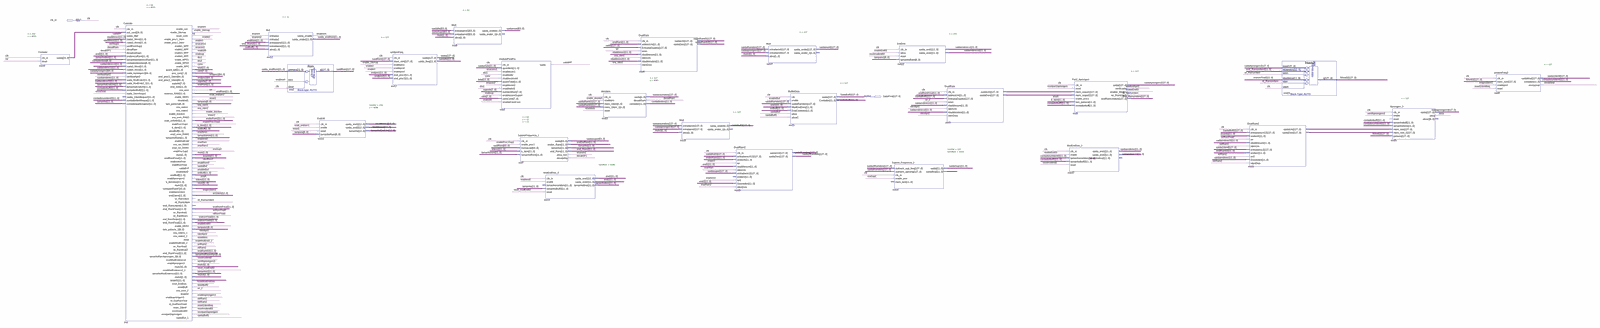
[diagram p0: schematic sheet, whole]
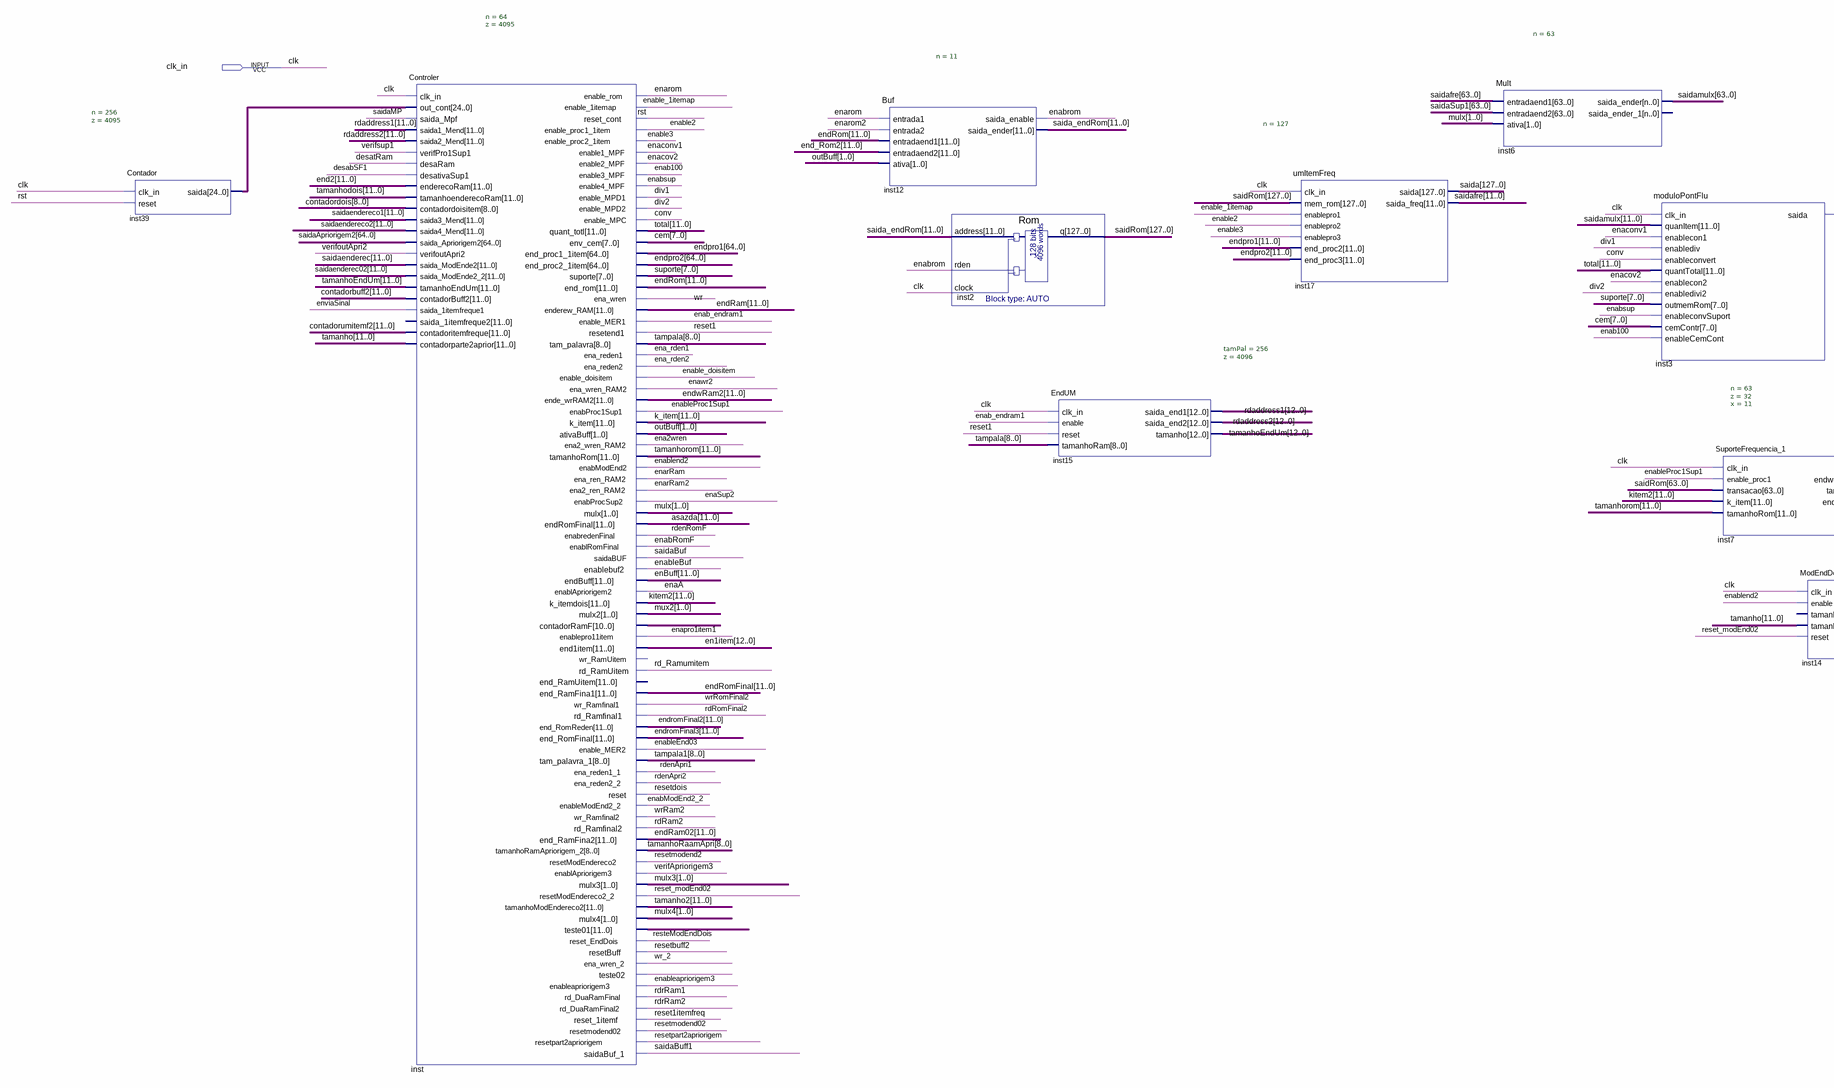
[diagram p1: schematic sheet, left part]
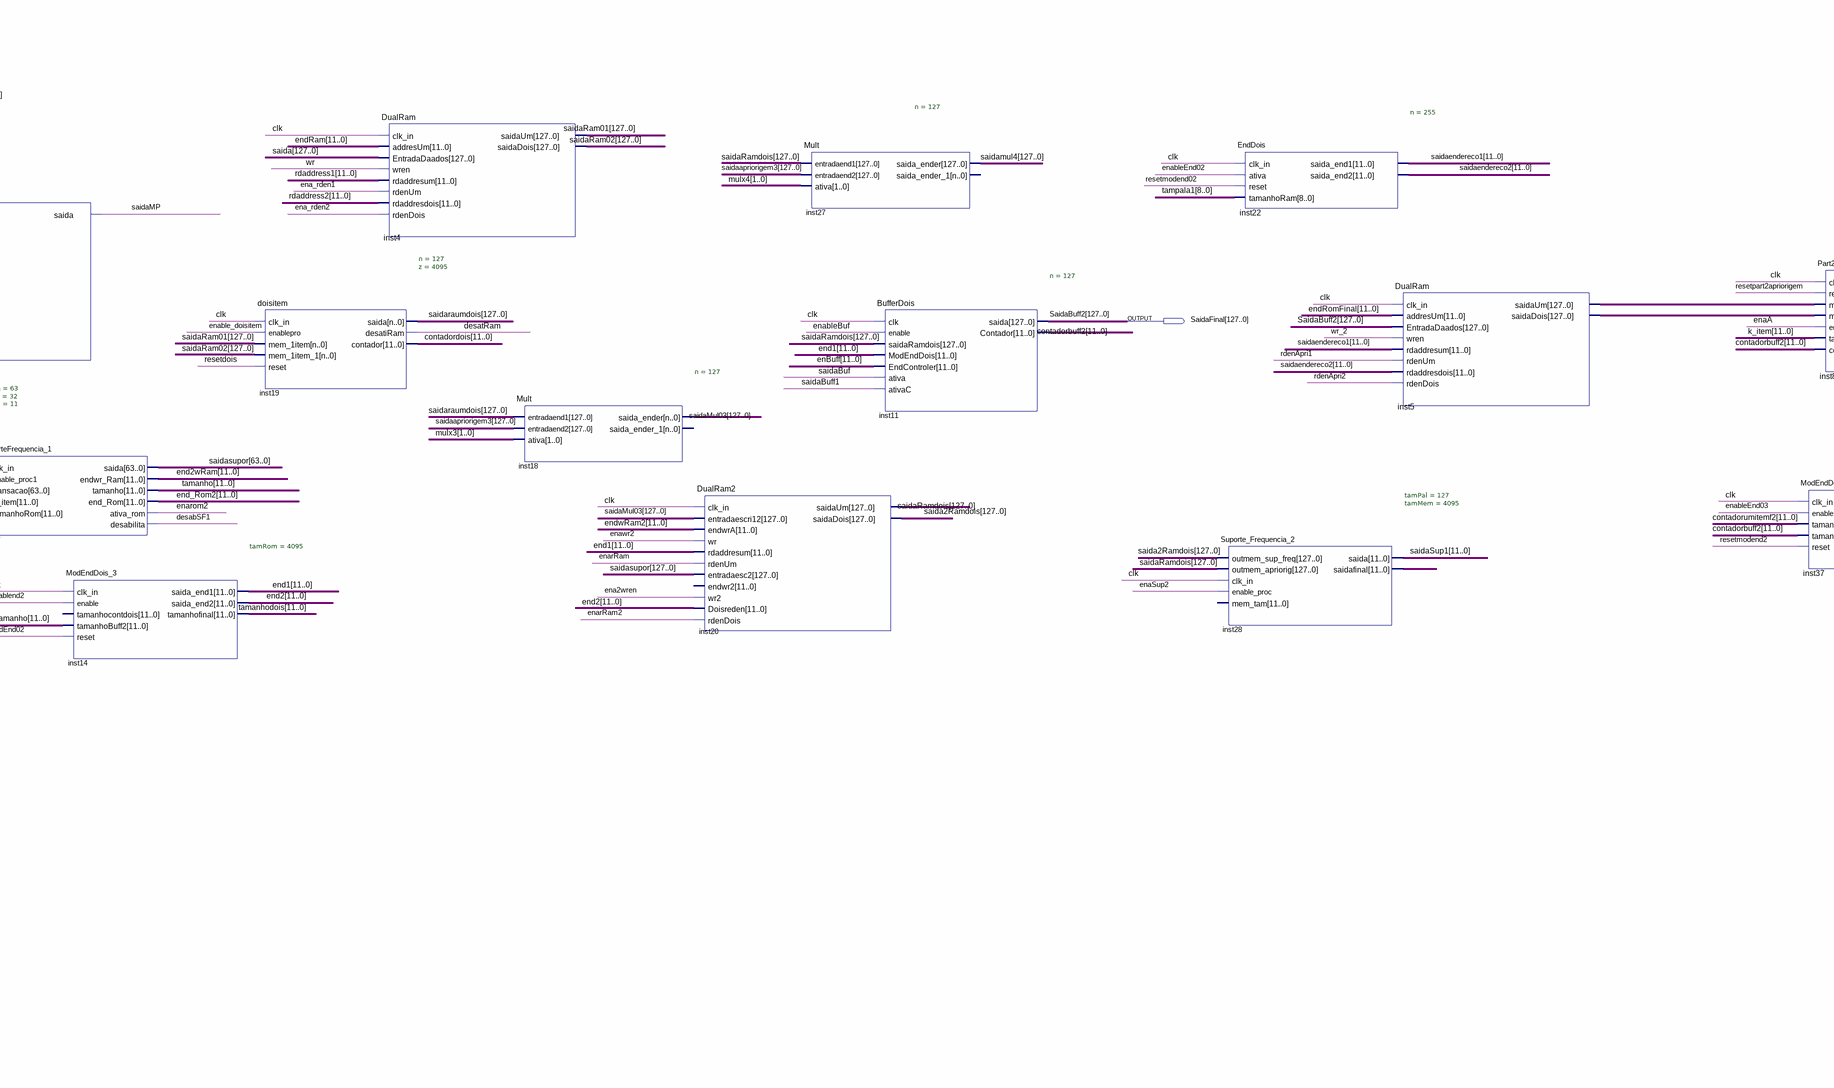
[diagram p2: schematic sheet, centre part]
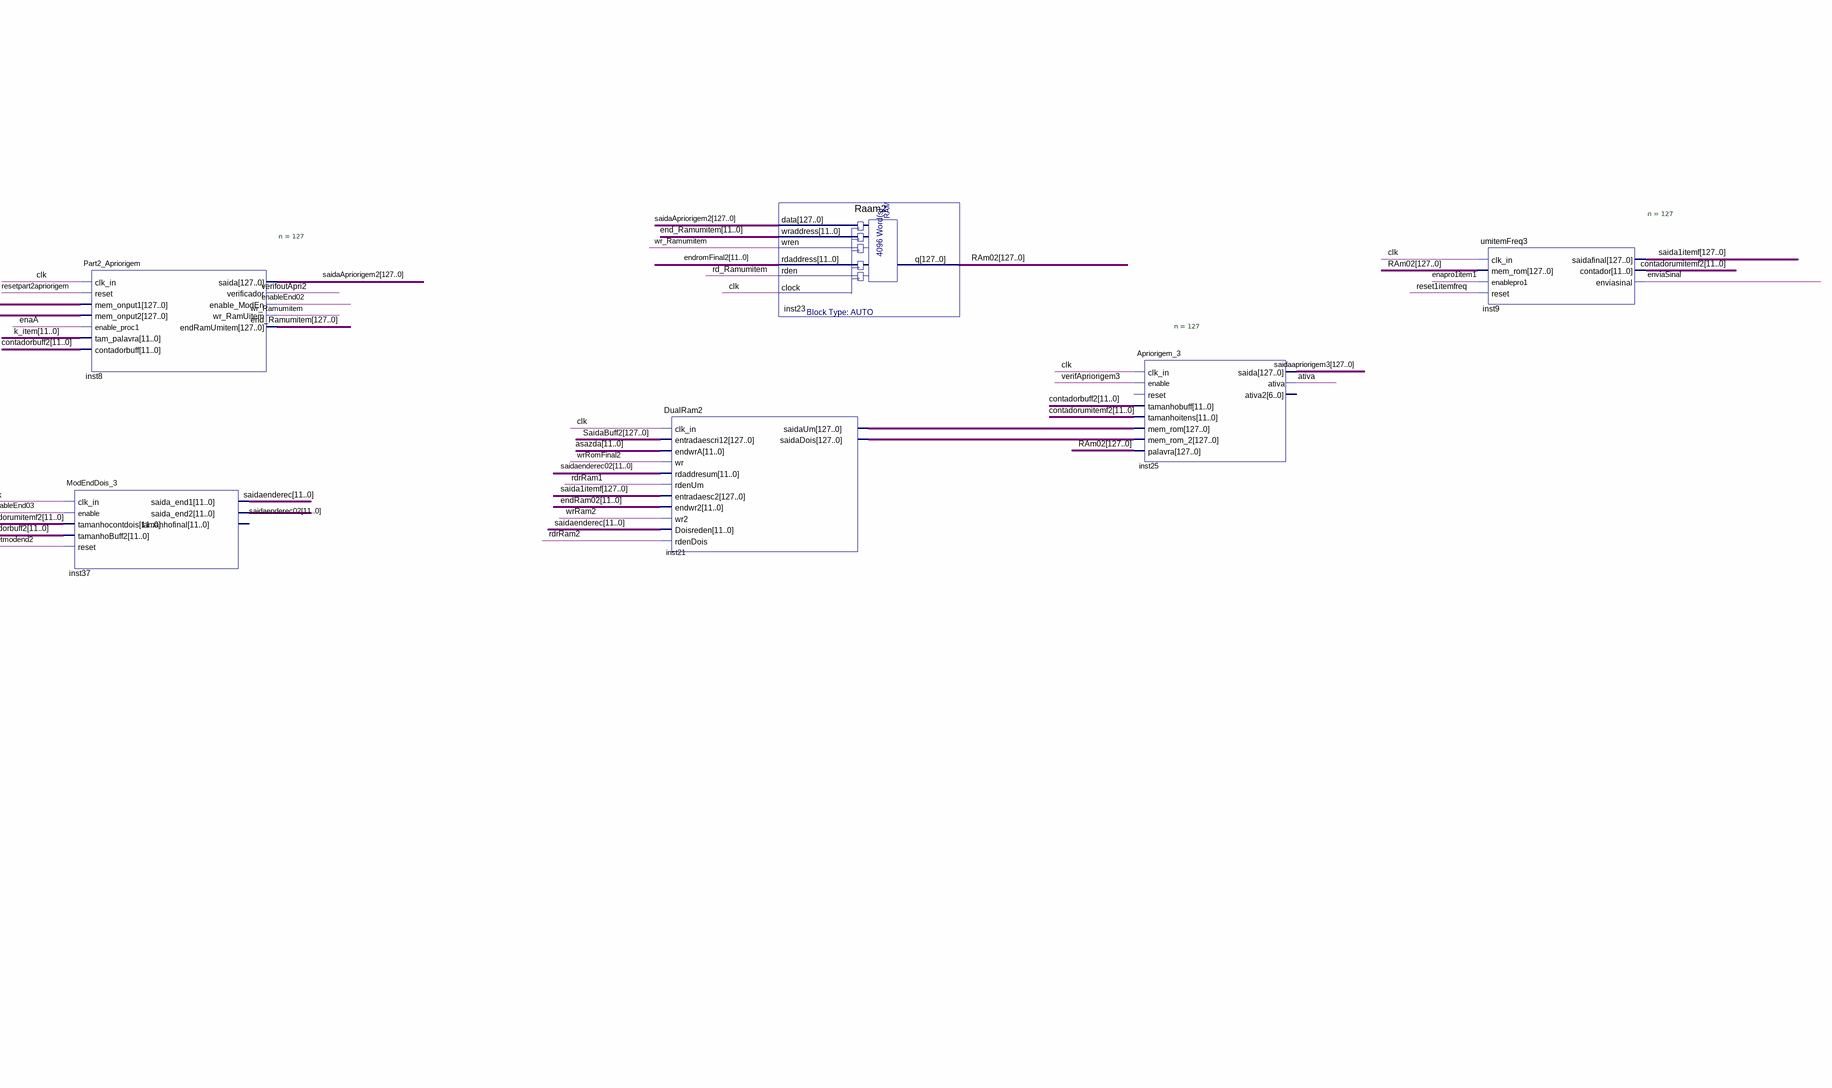
[diagram p3: schematic sheet, right part]
// Quartus schematic AprioriCerto.bdf as structural Verilog: 25 symbols, 2 pins
module AprioriCerto (
  input  clk_in,
  output [127:0] SaidaFinal
);

  wire ativa, conv, desabSF1, desatRam, div1, div2, ena2wren, ena_rden1, ena_rden2, enaA, enab100,
       enab_endram1, enable2, enable3, enable_1itemap, enable_doisitem, enableapriorigem3, enableBuf,
       enableEnd02, enableEnd03, enablend2, enableProc1Sup1, enabModEnd2_2, enabrom, enabRomF, enabsup,
       enaconv1, enacov2, enapro1item1, enarom, enarom2, enarRam, enarRam2, enaSup2, enawr2, enviaSinal,
       inst_teste02, rd_Ramumitem, rdenApri1, rdenApri2, rdenRomF, rdRam2, rdRomFinal2, rdrRam1, rdrRam2,
       reset1, reset1itemfreq, reset_modEnd02, resetbuff2, resetdois, resetmodend2, resetmodend02,
       resetpart2apriorigem, resteModEndDois, rst, saidaBuf, saidaBuff1, saidaMP, verifApriorigem3,
       verifoutApri2, verifsup1, wr, wr_2, wr_Ramumitem, wrRam2, wrRomFinal2;
  wire [1:0] mulx, mulx3, mulx4, mux2, outBuff;
  wire [7:0] cem, suporte;
  wire [8:0] tamanhoRaamApri, tampala, tampala1;
  wire [10:0] inst_contadorramf;
  wire [11:0] asazda, contadorbuff2, contadordois, contadorumitemf2, enBuff, end1, end2, end2wRam, end_Rom2,
       endRam, endRam02, endRom, endRomFinal, endromFinal2, endromFinal3, endwRam2, inst28_saidafinal,
       inst_teste01, k_item, kitem2, saida_endRom, saidaenderec, saidaenderec02, saidaendereco1,
       saidaendereco2, tamanho, tamanho2, tamanhodois, tamanhorom, total;
  wire [12:0] en1item, rdaddress1, rdaddress2, tamanhoEndUm;
  wire [24:0] inst39_saida;
  wire [63:0] saidafre, saidamulx, saidaSup1;
  wire [64:0] endpro1, endpro2;
  wire [127:0] end_Ramumitem, inst5_saidadois, inst5_saidaum, inst21_saidadois, inst21_saidaum, RAm02, saida,
       saida1itemf, saida2Ramdois, saidaApriorigem2, saidaapriorigem3, saidaMul03, saidamul4, saidaRam01,
       saidaRam02, saidaRamdois, saidaraumdois, saidasupor, saidRom;

  Contador #(.n(256), .z(4095)) inst39 (.clk_in(clk_in), .reset(rst), .saida(inst39_saida));
  Controler #(.n(64), .z(4095)) inst (
    .clk_in(clk_in), .out_cont(inst39_saida), .saida_Mpf(saidaMP), .saida1_Mend(rdaddress1[11:0]),
    .saida2_Mend(rdaddress2[11:0]), .verifPro1Sup1(verifsup1), .desaRam(desatRam), .desativaSup1(desabSF1),
    .enderecoRam(end2), .tamanhoenderecoRam(tamanhodois), .contadordoisitem(contadordois[8:0]),
    .saida3_Mend(saidaendereco1), .saida4_Mend(saidaendereco2), .saida_Apriorigem2(saidaApriorigem2[64:0]),
    .verifoutApri2(verifoutApri2), .saida_ModEnde2(saidaenderec), .saida_ModEnde2_2(saidaenderec02),
    .tamanhoEndUm(tamanhoEndUm[11:0]), .contadorBuff2(contadorbuff2), .saida_1itemfreque1(enviaSinal),
    .contadoritemfreque(contadorumitemf2), .contadorparte2aprior(tamanho), .enable_rom(enarom),
    .enable_1itemap(enable_1itemap), .reset_cont(rst), .enable_proc1_1item(enable2),
    .enable_proc2_1item(enable3), .enable1_MPF(enaconv1), .enable2_MPF(enacov2), .enable3_MPF(enab100),
    .enable4_MPF(enabsup), .enable_MPD1(div1), .enable_MPD2(div2), .enable_MPC(conv), .quant_totl(total),
    .env_cem(cem), .end_proc1_1item(endpro1), .end_proc2_1item(endpro2), .suporte(suporte), .end_rom(endRom),
    .ena_wren(wr), .enderew_RAM(endRam), .enable_MER1(enab_endram1), .resetend1(reset1),
    .tam_palavra(tampala), .ena_reden1(ena_rden1), .ena_reden2(ena_rden2), .enable_doisitem(enable_doisitem),
    .ena_wren_RAM2(enawr2), .ende_wrRAM2(endwRam2), .enabProc1Sup1(enableProc1Sup1), .k_item(k_item),
    .ativaBuff(outBuff), .ena2_wren_RAM2(ena2wren), .tamanhoRom(tamanhorom), .enabModEnd2(enablend2),
    .ena_ren_RAM2(enarRam), .ena2_ren_RAM2(enarRam2), .enabProcSup2(enaSup2), .mulx(mulx),
    .endRomFinal(asazda), .enabredenFinal(rdenRomF), .enablRomFinal(enabRomF), .saidaBUF(saidaBuf),
    .enablebuf2(enableBuf), .endBuff(enBuff), .enablApriorigem2(enaA), .k_itemdois(kitem2), .mulx2(mux2),
    .contadorRamF(inst_contadorramf), .enablepro11item(enapro1item1), .end1item(en1item),
    .rd_RamUitem(rd_Ramumitem), .end_RamFina1(endRomFinal), .wr_Ramfinal1(wrRomFinal2),
    .rd_Ramfinal1(rdRomFinal2), .end_RomReden(endromFinal2), .end_RomFinal(endromFinal3),
    .enable_MER2(enableEnd03), .tam_palavra_1(tampala1), .ena_reden1_1(rdenApri1), .ena_reden2_2(rdenApri2),
    .reset(resetdois), .enableModEnd2_2(enabModEnd2_2), .wr_Ramfinal2(wrRam2), .rd_Ramfinal2(rdRam2),
    .end_RamFina2(endRam02), .tamanhoRamApriorigem_2(tamanhoRaamApri), .resetModEndereco2(resetmodend2),
    .enablApriorigem3(verifApriorigem3), .mulx3(mulx3), .resetModEndereco2_2(reset_modEnd02),
    .tamanhoModEndereco2(tamanho2), .mulx4(mulx4), .teste01(inst_teste01), .reset_EndDois(resteModEndDois),
    .resetBuff(resetbuff2), .ena_wren_2(wr_2), .teste02(inst_teste02), .enableapriorigem3(enableapriorigem3),
    .rd_DuaRamFinal(rdrRam1), .rd_DuaRamFinal2(rdrRam2), .reset_1itemf(reset1itemfreq),
    .resetmodend02(resetmodend02), .resetpart2apriorigem(resetpart2apriorigem), .saidaBuf_1(saidaBuff1));  // open: saida_1itemfreque2, wr_RamUitem, end_RamUitem
  Buf #(.n(11)) inst12 (
    .entrada1(enarom), .entrada2(enarom2), .entradaend1(endRom), .entradaend2(end_Rom2), .ativa(outBuff),
    .saida_enable(enabrom), .saida_ender(saida_endRom));
  Rom inst2 (.address(saida_endRom), .rden(enabrom), .clock(clk_in), .q(saidRom));
  EndUM #(.tamPal(256), .z(4096)) inst15 (
    .clk_in(clk_in), .enable(enab_endram1), .reset(reset1), .tamanhoRam(tampala), .saida_end1(rdaddress1),
    .saida_end2(rdaddress2), .tamanho(tamanhoEndUm));
  umItemFreq #(.n(127)) inst17 (
    .clk_in(clk_in), .mem_rom(saidRom), .enablepro1(enable_1itemap), .enablepro2(enable2),
    .enablepro3(enable3), .end_proc2(endpro1[11:0]), .end_proc3(endpro2[11:0]), .saida(saida),
    .saida_freq(saidafre[11:0]));
  Mult #(.n(63)) inst6 (
    .entradaend1(saidafre), .entradaend2(saidaSup1), .ativa(mulx), .saida_ender(saidamulx));  // open: saida_ender_1
  moduloPontFlu inst3 (
    .clk_in(clk_in), .quanItem(saidamulx[11:0]), .enablecon1(enaconv1), .enablediv(div1),
    .enableconvert(conv), .quantTotal(total), .enablecon2(enacov2), .enabledivi2(div2), .outmemRom(suporte),
    .enableconvSuport(enabsup), .cemContr(cem), .enableCemCont(enab100), .saida(saidaMP));
  SuporteFrequencia_1 #(.n(63), .z(32), .x(11)) inst7 (
    .clk_in(clk_in), .enable_proc1(enableProc1Sup1), .transacao(saidRom[63:0]), .k_item(kitem2),
    .tamanhoRom(tamanhorom), .saida(saidasupor[63:0]), .endwr_Ram(end2wRam), .tamanho(tamanho),
    .end_Rom(end_Rom2), .ativa_rom(enarom2), .desabilita(desabSF1));
  ModEndDois_3 #(.tamRom(4095)) inst14 (
    .clk_in(clk_in), .enable(enablend2), .tamanhoBuff2(tamanho), .reset(reset_modEnd02), .saida_end1(end1),
    .saida_end2(end2), .tamanhofinal(tamanhodois));  // open: tamanhocontdois
  doisitem #(.n(127), .z(4095)) inst19 (
    .clk_in(clk_in), .enablepro(enable_doisitem), .mem_1item(saidaRam01), .mem_1item_1(saidaRam02),
    .reset(resetdois), .saida(saidaraumdois), .desatiRam(desatRam), .contador(contadordois));
  DualRam inst4 (
    .clk_in(clk_in), .addresUm(endRam), .EntradaDaados(saida), .wren(wr), .rdaddresum(rdaddress1[11:0]),
    .rdenUm(ena_rden1), .rdaddresdois(rdaddress2[11:0]), .rdenDois(ena_rden2), .saidaUm(saidaRam01),
    .saidaDois(saidaRam02));
  Mult #(.n(127)) inst18 (
    .entradaend1(saidaraumdois), .entradaend2(saidaapriorigem3), .ativa(mulx3), .saida_ender(saidaMul03));  // open: saida_ender_1
  DualRam2 inst20 (
    .clk_in(clk_in), .entradaescri12(saidaMul03), .endwrA(endwRam2), .wr(enawr2), .rdaddresum(end1),
    .rdenUm(enarRam), .entradaesc2(saidasupor), .wr2(ena2wren), .Doisreden(end2), .rdenDois(enarRam2),
    .saidaUm(saidaRamdois), .saidaDois(saida2Ramdois));  // open: endwr2
  Mult #(.n(127)) inst27 (
    .entradaend1(saidaRamdois), .entradaend2(saidaapriorigem3), .ativa(mulx4), .saida_ender(saidamul4));  // open: saida_ender_1
  BufferDois #(.n(127)) inst11 (
    .clk(clk_in), .enable(enableBuf), .saidaRamdois(saidaRamdois), .ModEndDois(end1), .EndControler(enBuff),
    .ativa(saidaBuf), .ativaC(saidaBuff1), .saida(SaidaFinal), .Contador(contadorbuff2));
  Suporte_Frequencia_2 #(.tamPal(127), .tamMem(4095)) inst28 (
    .outmem_sup_freq(saida2Ramdois), .outmem_apriorig(saidaRamdois), .clk_in(clk_in), .enable_proc(enaSup2),
    .saida(saidaSup1[11:0]), .saidafinal(inst28_saidafinal));  // open: mem_tam
  EndDois #(.n(255)) inst22 (
    .clk_in(clk_in), .ativa(enableEnd02), .reset(resetmodend02), .tamanhoRam(tampala1),
    .saida_end1(saidaendereco1), .saida_end2(saidaendereco2));
  DualRam inst5 (
    .clk_in(clk_in), .addresUm(endRomFinal), .EntradaDaados(SaidaFinal), .wren(wr_2),
    .rdaddresum(saidaendereco1), .rdenUm(rdenApri1), .rdaddresdois(saidaendereco2), .rdenDois(rdenApri2),
    .saidaUm(inst5_saidaum), .saidaDois(inst5_saidadois));
  ModEndDois_3 inst37 (
    .clk_in(clk_in), .enable(enableEnd03), .tamanhocontdois(contadorumitemf2), .tamanhoBuff2(contadorbuff2),
    .reset(resetmodend2), .saida_end1(saidaenderec), .saida_end2(saidaenderec02));  // open: tamanhofinal
  Part2_Apriorigem #(.n(127)) inst8 (
    .clk_in(clk_in), .reset(resetpart2apriorigem), .mem_onput1(inst5_saidaum), .mem_onput2(inst5_saidadois),
    .enable_proc1(enaA), .tam_palavra(k_item), .contadorbuff(contadorbuff2), .saida(saidaApriorigem2),
    .verificador(verifoutApri2), .enable_ModEn(enableEnd02), .wr_RamUitem(wr_Ramumitem),
    .endRamUmitem(end_Ramumitem));
  DualRam2 inst21 (
    .clk_in(clk_in), .entradaescri12(SaidaFinal), .endwrA(asazda), .wr(wrRomFinal2),
    .rdaddresum(saidaenderec02), .rdenUm(rdrRam1), .entradaesc2(saida1itemf), .endwr2(endRam02),
    .wr2(wrRam2), .Doisreden(saidaenderec), .rdenDois(rdrRam2), .saidaUm(inst21_saidaum),
    .saidaDois(inst21_saidadois));
  Raam2 inst23 (
    .data(saidaApriorigem2), .wraddress(end_Ramumitem[11:0]), .wren(wr_Ramumitem), .rdaddress(endromFinal2),
    .rden(rd_Ramumitem), .clock(clk_in), .q(RAm02));
  Apriorigem_3 #(.n(127)) inst25 (
    .clk_in(clk_in), .enable(verifApriorigem3), .tamanhobuff(contadorbuff2), .tamanhoitens(contadorumitemf2),
    .mem_rom(inst21_saidaum), .mem_rom_2(inst21_saidadois), .palavra(RAm02), .saida(saidaapriorigem3),
    .ativa(ativa));  // open: reset, ativa2
  umitemFreq3 #(.n(127)) inst9 (
    .clk_in(clk_in), .mem_rom(RAm02), .enablepro1(enapro1item1), .reset(reset1itemfreq),
    .saidafinal(saida1itemf), .contador(contadorumitemf2), .enviasinal(enviaSinal));

  // Other names for the same wires on the sheet: clk = clk_in; SaidaBuff2[127:0] = SaidaFinal
endmodule
